# EAGLE design GSM-GSR (EAGLE 6.6.0)
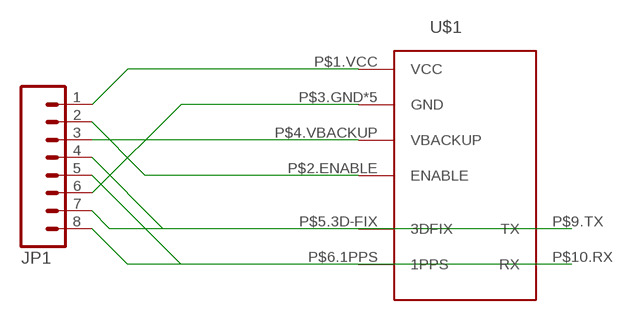
[diagram p0: schematic, sheet 1]

## Parts
JP1  M08LONGPADS  [1X08_LONGPADS]
U$1  GPS-GMR  [GMS-HPR]

## Nets
GND: JP1.6 U$1.P$3.GND(GND) U$1.P$8.GND(GND) U$1.P$11.GND(GND) U$1.P$12.GND(GND) U$1.P$13.GND(GND)
N$1: JP1.1 U$1.P$1.VCC(VCC)
N$2: JP1.2 U$1.P$2.ENABLE(ENABLE)
N$3: JP1.3 U$1.P$4.VBACKUP(VBACKUP)
N$4: JP1.4 U$1.P$5.3D-FIX(3DFIX)
N$5: JP1.5 U$1.P$6.1PPS(1PPS)
N$7: JP1.7 U$1.P$9.TX(TX)
N$8: JP1.8 U$1.P$10.RX(RX)

## Library data of the parts
JP1 = iStivi - Header-Connector:M08: Header 8 Standard 8-pin 0.1" header. Use with straight break away headers (SKU : PRT-00116), right angle break away headers (PRT-00553), swiss pins (PRT-00743), machine pins (PRT-00117), and female headers (PRT-00115).
U$1 = iStivi - GPS Modules:GPS-GMR

## Board
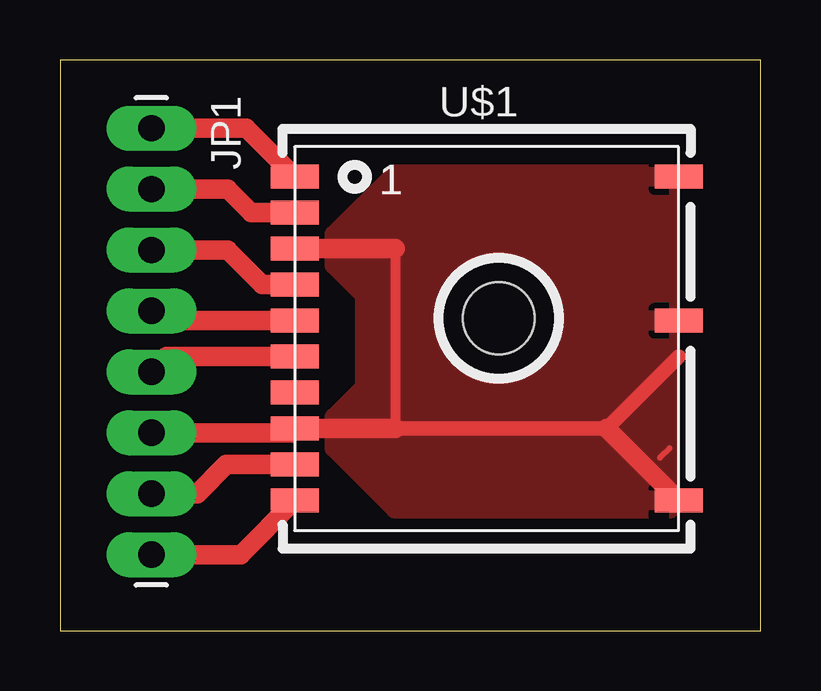
[diagram p1: board, top side]

Size 29.19 x 23.8 mm. Coordinates in mm from the lower left corner, seen from the top.
Outline: 0,0 29.19,0 29.19,23.8 0,23.8 0,0
Copper layers (1*16): Top 0.035mm / dielectric 1.5mm / Bottom 0.035mm
Design rules "default *": minimum track width 10mil, minimum drill 0.6mm, track to track 8mil, track to pad 8mil, pad to pad 8mil, via to via 8mil, smd to smd 8mil, copper to edge 40mil, drill to drill 8mil, minimum pad ring 10mil, minimum via ring 8mil, stop-mask expansion 4mil, vias tented up to drill 0mil, thermal gap 10mil

### Footprints (pad centres in the part's own frame; a part is rotated, then mirrored left to right if it is on the bottom)
1X08_LONGPADS = drill 1.1 pad 1.88 long: 1 0,0; 2 2.54,0; 3 5.08,0; 4 7.62,0; 5 10.16,0; 6 12.7,0; 7 15.24,0; 8 17.78,0
GMS-HPR = smd 2 x 1: P$1.VCC -8,7.5; P$2.ENABLE -8,6; P$3.GND -8,4.5; P$4.VBACKUP -8,3; P$5.3D-FIX -8,1.5; P$6.1PPS -8,0; P$7.NC -8,-1.5; P$8.GND -8,-3; P$9.TX -8,-4.5; P$10.RX -8,-6; P$11.GND 8,-6; P$12.GND 8,1.5; P$13.GND 8,7.5 | hole 3: 0.5,1.6

### Placement (x,y rotation side)
JP1  3.81,20.95 270 top
U$1  17.78,11.43 0 top

### Tracks (layer width: path | path; a pad name or v marks a point on that pad's centre or on a via)
GND  (2 unrouted)
  Top 0.254: 25.4,7.62 25,7.22
  Top 0.406: 13.97,15.93 13.97,8.43
  Top 0.61: 13.97,8.43 22.78,8.43 25.78,11.43 | U$1.P$8.GND 9.61,8.26
  Top 0.813: U$1.P$11.GND 22.78,8.43 | 13.97,8.43 U$1.P$8.GND | 9.61,8.26 JP1.6 | U$1.P$3.GND 13.97,15.93
  pour Top: 11.43,8.89 12.7,10.16 12.7,13.97 11.43,15.24 11.43,16.51 13.97,19.05 25.4,19.05 25.4,5.08 13.97,5.08 11.43,7.62
N$1
  Top 0.813: U$1.P$1.VCC 7.75,20.95 JP1.1
N$2
  Top 0.813: U$1.P$2.ENABLE 7.97,17.43 6.99,18.41 JP1.2
N$3
  Top 0.813: U$1.P$4.VBACKUP 8.43,14.43 6.99,15.88 JP1.3
N$4
  Top 0.813: U$1.P$5.3D-FIX 4.21,12.93 JP1.4
N$5
  Top 0.813: U$1.P$6.1PPS 4.45,11.43 JP1.5
N$7
  Top 0.813: U$1.P$9.TX 6.93,6.93 5.71,5.71 JP1.7
N$8
  Top 0.813: U$1.P$10.RX 7.53,3.17 JP1.8